# EAGLE design main (EAGLE 6.6.0)
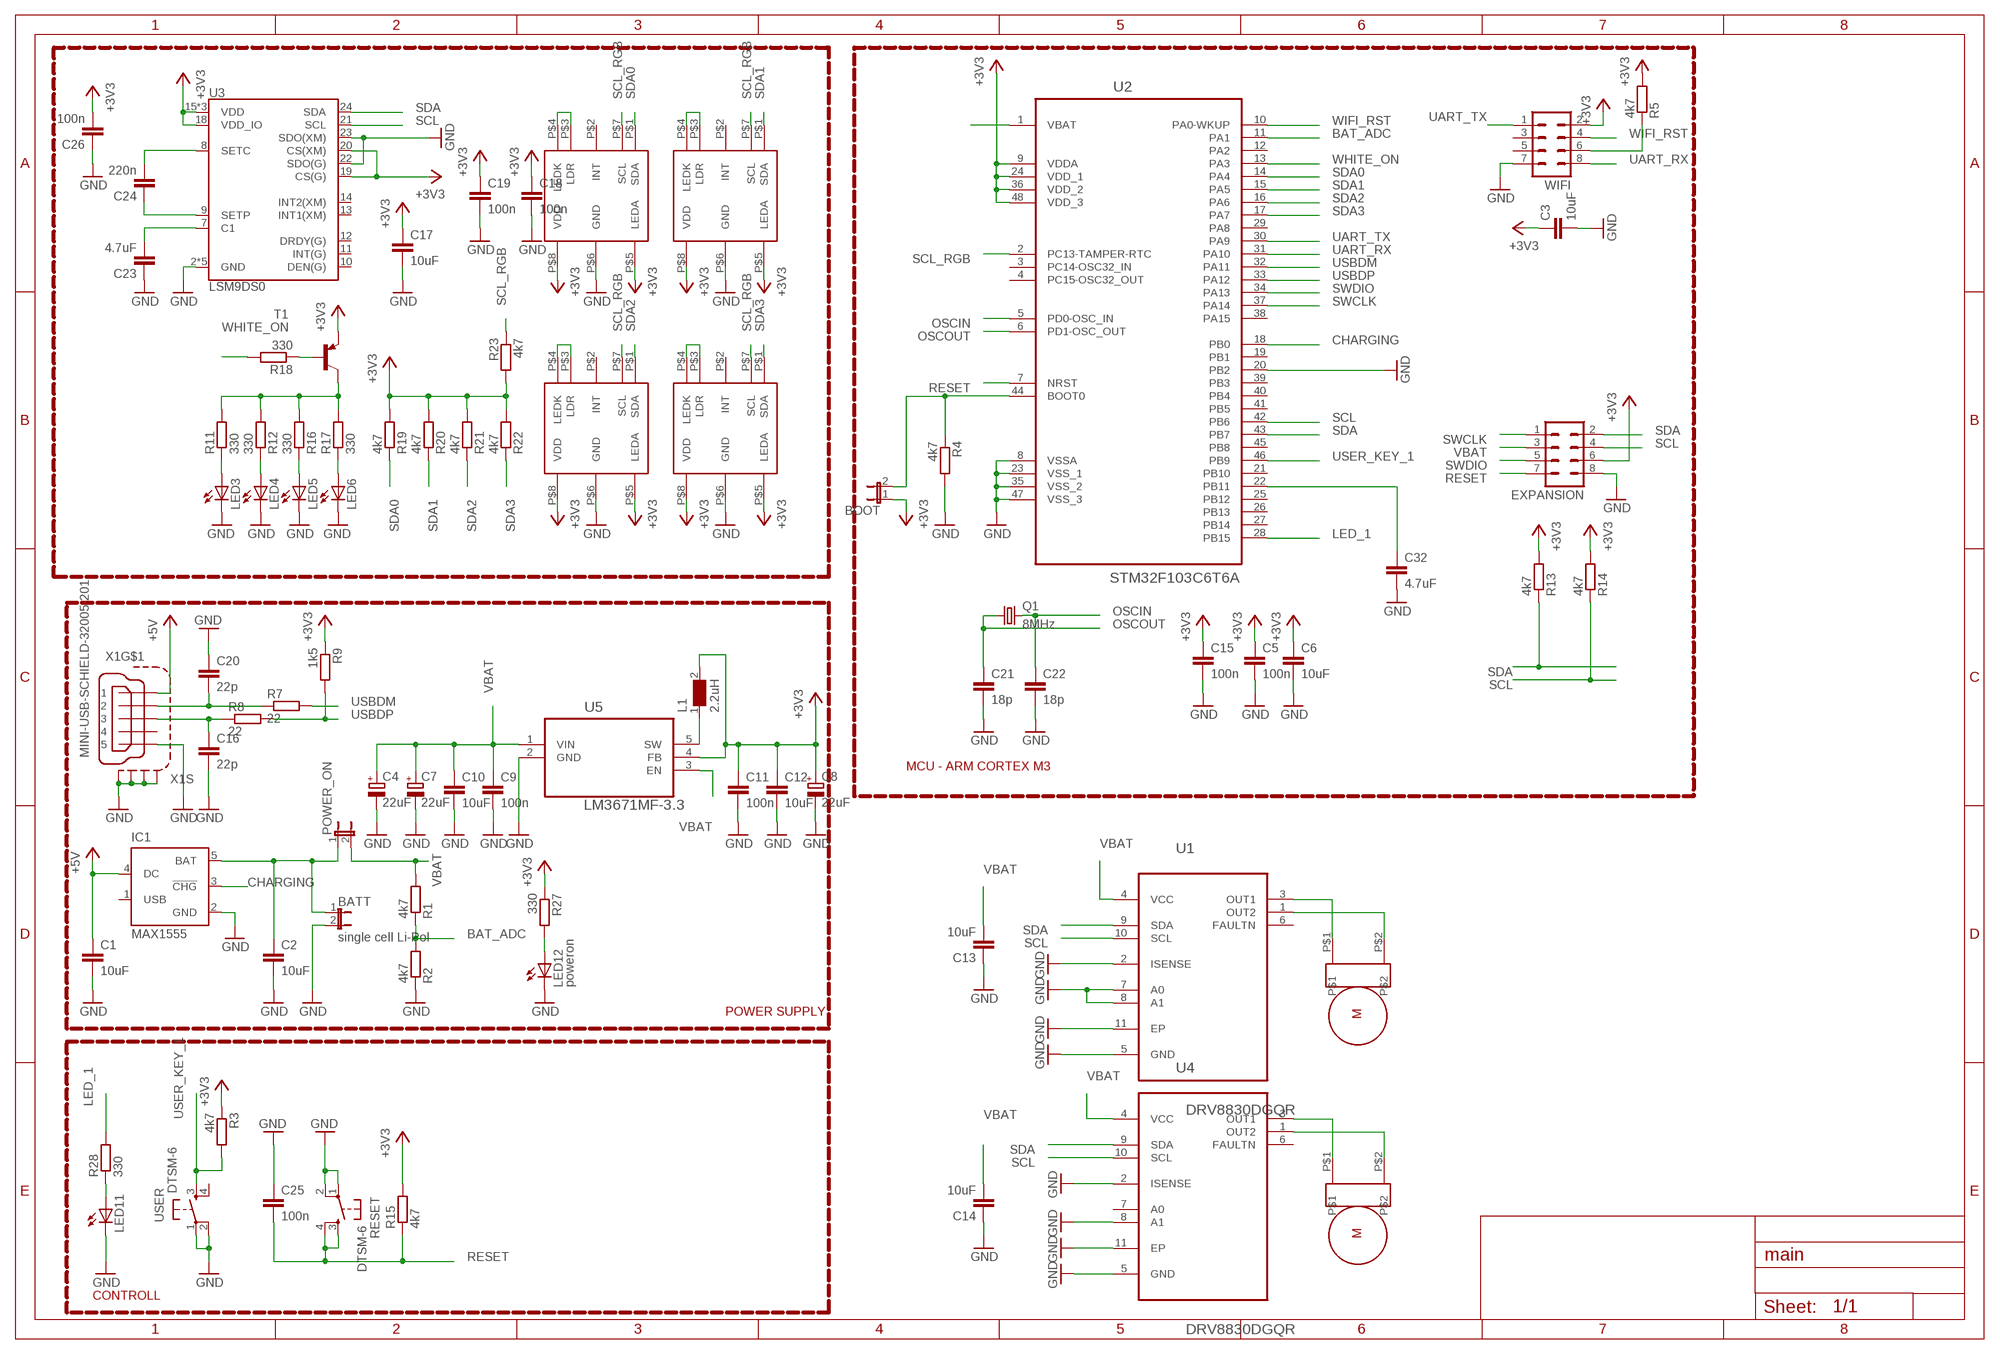
[diagram p0: schematic, sheet 1]

## Parts
BATT  single cell Li-Pol  JP1E  [JP1]
BOOT  JP1E  [JP1]
C1  10uF  C-EUC0805  [C0805]
C2  10uF  C-EUC0805  [C0805]
C3  10uF  C-EUC0805  [C0805]
C4  22uF  CPOL-EU153CLV-0505  [153CLV-0505]
C5  100n  C-EUC0805  [C0805]
C6  10uF  C-EUC0805  [C0805]
C7  22uF  CPOL-EU153CLV-0505  [153CLV-0505]
C8  22uF  CPOL-EU153CLV-0505  [153CLV-0505]
C9  100n  C-EUC0805  [C0805]
C10  10uF  C-EUC0805  [C0805]
C11  100n  C-EUC0805  [C0805]
C12  10uF  C-EUC0805  [C0805]
C13  10uF  C-EUC0805  [C0805]
C14  10uF  C-EUC0805  [C0805]
C15  100n  C-EUC0805  [C0805]
C16  22p  C-EUC0805  [C0805]
C17  10uF  C-EUC0805  [C0805]
C18  100n  C-EUC0805  [C0805]
C19  100n  C-EUC0805  [C0805]
C20  22p  C-EUC0805  [C0805]
C21  18p  C-EUC0805  [C0805]
C22  18p  C-EUC0805  [C0805]
C23  4.7uF  C-EUC0805  [C0805]
C24  220n  C-EUC0805  [C0805]
C25  100n  C-EUC0805  [C0805]
C26  100n  C-EUC0805  [C0805]
C32  4.7uF  C-EUC0805  [C0805]
EXPANSION  MA04-2  [MA04-2]
IC1  MAX1555  [SOT23-5L]
L1  2.2uH  WE-LQ-744032002_M  [WE-LQ_M]
LED3  LEDCHIPLED_1206  [CHIPLED_1206]
LED4  LEDCHIPLED_1206  [CHIPLED_1206]
LED5  LEDCHIPLED_1206  [CHIPLED_1206]
LED6  LEDCHIPLED_1206  [CHIPLED_1206]
LED11  LEDCHIPLED_1206  [CHIPLED_1206]
LED12  poweron  LEDCHIPLED_1206  [CHIPLED_1206]
POWER_ON  JP1E  [JP1]
Q1  8MHz  CRYSTALCTS406  [CTS406]
R1  4k7  R-EU_M0805  [M0805]
R2  4k7  R-EU_M0805  [M0805]
R3  4k7  R-EU_M0805  [M0805]
R4  4k7  R-EU_M0805  [M0805]
R5  4k7  R-EU_M0805  [M0805]
R7  22  R-EU_M0805  [M0805]
R8  22  R-EU_M0805  [M0805]
R9  1k5  R-EU_M0805  [M0805]
R11  330  R-EU_M0805  [M0805]
R12  330  R-EU_M0805  [M0805]
R13  4k7  R-EU_M0805  [M0805]
R14  4k7  R-EU_M0805  [M0805]
R15  4k7  R-EU_M0805  [M0805]
R16  330  R-EU_M0805  [M0805]
R17  330  R-EU_M0805  [M0805]
R18  330  R-EU_M0805  [M0805]
R19  4k7  R-EU_M0805  [M0805]
R20  4k7  R-EU_M0805  [M0805]
R21  4k7  R-EU_M0805  [M0805]
R22  4k7  R-EU_M0805  [M0805]
R23  4k7  R-EU_M0805  [M0805]
R27  330  R-EU_M0805  [M0805]
R28  330  R-EU_M0805  [M0805]
RESET  DTSM-6  [DTSM-6]
T1  BC857A-PNP-SOT23-BEC  [SOT23-BEC]
U1  DRV8830DGQR  [SOP65P640X110-15N]
U2  STM32F103C6T6A  [QFP50P900X900X160-48N]
U3  LSM9DS0  [LGA-24]
U4  DRV8830DGQR  [SOP65P640X110-15N]
U5  LM3671MF-3.3  [SOT95P284X122-5N]
U$1  APDS9950  [APDS9950]
U$2  APDS9950  [APDS9950]
U$3  APDS9950  [APDS9950]
U$4  APDS9950  [APDS9950]
U$5  MICRO_METAL_GEAR_MOTOR  [MICRO_METAL_GEAR_MOTOR]
U$6  MICRO_METAL_GEAR_MOTOR  [MICRO_METAL_GEAR_MOTOR]
USER  DTSM-6  [DTSM-6]
WIFI  MA04-2  [MA04-2]
X1  MINI-USB-SCHIELD-32005-201  [32005-201]

## Nets
+3V3: BOOT.1 C3.1 C5.1 C6.1 C8.+ C11.1 C12.1 C15.1 C17.1 C18.1 C19.1 C26.2 EXPANSION.6 L1.2 R3.1 R5.2 R9.1 R13.2 R14.2 R15.2 R19.2 R20.2 R21.2 R22.2 R23.2 R27.1 T1.E U2.9(VDDA) U2.24(VDD_1) U2.36(VDD_2) U2.48(VDD_3) U3.15(VDD) U3.16(VDD) U3.17(VDD) U3.18(VDD_IO) U3.19(CS(G)) U3.20(CS(XM)) U5.4(FB) U$1.P$5(LEDA) U$1.P$8(VDD) U$2.P$5(LEDA) U$2.P$8(VDD) U$3.P$5(LEDA) U$3.P$8(VDD) U$4.P$5(LEDA) U$4.P$8(VDD) WIFI.2
+5V: C1.1 IC1.4(DC) X1.1
BAT_ADC: R1.1 R2.2 U2.11(PA1)
CHARGING: IC1.3(!CHG) U2.18(PB0)
GND: BATT.2 C1.2 C2.2 C3.2 C4.- C5.2 C6.2 C7.- C8.- C9.2 C10.2 C11.2 C12.2 C13.1 C14.1 C15.2 C16.2 C17.2 C18.2 C19.2 C20.1 C21.2 C22.2 C23.1 C25.1 C26.1 C32.2 EXPANSION.8 IC1.2(GND) LED3.C LED4.C LED5.C LED6.C LED11.C LED12.C R2.1 R4.2 RESET.1 RESET.2 U1.2(ISENSE) U1.5(GND) U1.7(A0) U1.8(A1) U1.11(EP) U2.8(VSSA) U2.20(PB2) U2.23(VSS_1) U2.35(VSS_2) U2.47(VSS_3) U3.2(GND) U3.3(GND) U3.4(GND) U3.5(GND) U3.6(GND) U3.22(SDO(G)) U3.23(SDO(XM)) U4.2(ISENSE) U4.5(GND) U4.8(A1) U4.11(EP) U5.2(GND) U$1.P$6(GND) U$2.P$6(GND) U$3.P$6(GND) U$4.P$6(GND) USER.1 USER.2 WIFI.7 X1.5 X1.M1(S:S1) X1.M2(S:S2) X1.M3(S:S3) X1.M4(S:S4)
LED_1: R28.2 U2.28(PB15)
N$1: R5.1 WIFI.6
N$2: BATT.1 C2.1 IC1.5(BAT) POWER_ON.1
N$3: U1.1(OUT2) U$5.P$2
N$4: U1.3(OUT1) U$5.P$1
N$5: U4.1(OUT2) U$6.P$2
N$6: C23.2 U3.7(C1)
N$7: C24.2 U3.8(SETC)
N$8: U4.3(OUT1) U$6.P$1
N$9: L1.1 U5.5(SW)
N$13: C24.1 U3.9(SETP)
N$14: C32.1 U2.22(PB11)
N$15: LED3.A R11.1
N$16: BOOT.2 R4.1 U2.44(BOOT0)
N$17: U$1.P$3(LDR) U$1.P$4(LEDK)
N$18: U$2.P$3(LDR) U$2.P$4(LEDK)
N$19: U$3.P$3(LDR) U$3.P$4(LEDK)
N$20: U$4.P$3(LDR) U$4.P$4(LEDK)
N$22: LED4.A R12.1
N$23: LED12.A R27.2
N$24: LED5.A R16.1
N$25: LED6.A R17.1
N$26: R11.2 R12.2 R16.2 R17.2 T1.C
N$27: R18.1 T1.B
N$33: LED11.A R28.1
N$55: C20.2 R7.1 X1.2
N$56: C16.1 R8.1 X1.3
NC: U2.1(VBAT)
OSCIN: C22.1 Q1.3 U2.5(PD0-OSC_IN)
OSCOUT: C21.1 Q1.1 U2.6(PD1-OSC_OUT)
RESET: C25.2 EXPANSION.7 R15.1 RESET.3 RESET.4 U2.7(NRST)
SCL: EXPANSION.4 R14.1 U1.10(SCL) U2.42(PB6) U3.21(SCL) U4.10(SCL)
SCL_RGB: R23.1 U2.2(PC13-TAMPER-RTC) U$1.P$7(SCL) U$2.P$7(SCL) U$3.P$7(SCL) U$4.P$7(SCL)
SDA: EXPANSION.2 R13.1 U1.9(SDA) U2.43(PB7) U3.24(SDA) U4.9(SDA)
SDA0: R19.1 U2.14(PA4) U$1.P$1(SDA)
SDA1: R20.1 U2.15(PA5) U$2.P$1(SDA)
SDA2: R21.1 U2.16(PA6) U$3.P$1(SDA)
SDA3: R22.1 U2.17(PA7) U$4.P$1(SDA)
SWCLK: EXPANSION.1 U2.37(PA14)
SWDIO: EXPANSION.5 U2.34(PA13)
UART_RX: U2.31(PA10) WIFI.8
UART_TX: U2.30(PA9) WIFI.1
USBDM: R7.2 U2.32(PA11)
USBDP: R8.2 R9.2 U2.33(PA12)
USER_KEY_1: R3.2 U2.46(PB9) USER.3
VBAT: C4.+ C7.+ C9.1 C10.1 C13.2 C14.2 EXPANSION.3 POWER_ON.2 R1.2 U1.4(VCC) U4.4(VCC) U5.1(VIN) U5.3(EN)
WHITE_ON: R18.2 U2.13(PA3)
WIFI_RST: U2.10(PA0-WKUP) WIFI.4
Unconnected: IC1.1(USB) U1.6(FAULTN) U2.3(PC14-OSC32_IN) U2.4(PC15-OSC32_OUT) U2.12(PA2) U2.19(PB1) U2.21(PB10) U2.25(PB12) U2.26(PB13) U2.27(PB14) U2.29(PA8) U2.38(PA15) U2.39(PB3) U2.40(PB4) U2.41(PB5) U2.45(PB8) U3.10(DEN(G)) U3.11(INT(G)) U3.12(DRDY(G)) U3.13(INT1(XM)) U3.14(INT2(XM)) U4.6(FAULTN) U4.7(A0) U$1.P$2(INT) U$2.P$2(INT) U$3.P$2(INT) U$4.P$2(INT) USER.4 WIFI.3 WIFI.5 X1.4

## Notes on the sheet
- MCU - ARM CORTEX M3
- POWER SUPPLY
- CONTROLL

## Library data of the parts
BATT BOOT POWER_ON = jumper:JP1E: JUMPER
C1-C3 C5 C6 C9-C26 C32 = resistor:C-EU: CAPACITOR, European symbol
C4 C7 C8 = resistor:CPOL-EU: POLARIZED CAPACITOR, European symbol
EXPANSION WIFI = con-lstb:MA04-2: PIN HEADER; OC_FARNELL: unknown; OC_NEWARK: unknown
IC1 = maxim:MAX1555: Dual-Input USB/AC Adapter 1-Cell Li+ Battery Chargers Source: http://www.maxim-ic.com .. MAX1551-MAX1555.pdf; MF: MAXIM; MPN: MAX1555EZK+T; OC_FARNELL: 1628222; OC_NEWARK: 59J2761
L1 = WE-LQ:WE-LQ: SMD RF Inductor WE-LQ - High Q at high frequences - Low DC-resistance - Miniature chip inductor wound on a special ferrite core -- Low power DC/DC-converters from Linear Technology, National Semiconductor, Texas Instruments and Fairchild Semiconductor ect. -- Test & measurement equipment -- EMI-Filtering -- RF-circuit; MPN: 744032002; OC_FARNELL: 1800378; OC_NEWARK: 78R5670; PACKAGE: 1210; SUPPLIER: WURTH ELEKTRONIK
LED3-LED6 LED11 LED12 = led:LED: LED OSRAM: - CHIPLED LG R971, LG N971, LY N971, LG Q971, LY Q971, LO R971, LY R971 LH N974, LH R974 LS Q976, LO Q976, LY Q976 LO Q996 - Hyper CHIPLED LW Q18S LB Q993, LB Q99A, LB R99A - SideLED LS A670, LO A670, LY A670, LG A670, LP A670 LB A673, LV A673, LT A673, LW A673 LH A674 LY A675 LS A676, LA A676, LO A676, LY A676, LW A676 LS A679, LY A679, LG A679 - Hyper Micro SIDELED® LS Y876, LA Y876, LO Y876, LY Y876 LT Y87S - SmartLED LW L88C, LW L88S LB L89C, LB L89S, LG L890 LS L89K, LO L89K, LY L89K LS L896, LA L896, LO L896, LY L896 - TOPLED LS T670, LO T670, LY T670, LG T670, LP T670 LSG T670, LSP T670, LSY T670, LOP T670, LYG T670 LG T671, LOG T671, LSG T671 LB T673, LV T673, LT T673, LW T673 LH T674 LS T676, LA T676, LO T676, LY T676, LB T676, LH T676, LSB T676, LW T676 LB T67C, LV T67C, LT T67C, LS T67K, LO T67K, LY T67K, LW E67C LS E67B, LA E67B, LO E67B, LY E67B, LB E67C, LV E67C, LT E67C LW T67C LS T679, LY T679, LG T679 LS T770, LO T770, LY T770, LG T770, LP T770 LB T773, LV T773, LT T773, LW T773 LH T774 LS E675, LA E675, LY E675, LS T675 LS T776, LA T776, LO T776, LY T776, LB T776 LHGB T686 LT T68C, LB T68C - Hyper Mini TOPLED® LB M676 - Mini TOPLED Santana® LG M470 LS M47K, LO M47K, LY M47K Source: http://www.osram.convergy.de LUXEON: - LUMILED® LXK2-PW12-R00, LXK2-PW12-S00, LXK2-PW14-U00, LXK2-PW14-V00 LXK2-PM12-R00, LXK2-PM12-S00, LXK2-PM14-U00 LXK2-PE12-Q00, LXK2-PE12-R00, LXK2-PE12-S00, LXK2-PE14-T00, LXK2-PE14-U00 LXK2-PB12-K00, LXK2-PB12-L00, LXK2-PB12-M00, LXK2-PB14-N00, LXK2-PB14-P00, LXK2-PB14-Q00 LXK2-PR12-L00, LXK2-PR12-M00, LXK2-PR14-Q00, LXK2-PR14-R00 LXK2-PD12-Q00, LXK2-PD12-R00, LXK2-PD12-S00 LXK2-PH12-R00, LXK2-PH12-S00 LXK2-PL12-P00, LXK2-PL12-Q00, LXK2-PL12-R00 Source: www.luxeon.com KINGBRIGHT: KA-3528ASYC Source: www.kingbright.com
Q1 = crystal:CRYSTAL: CRYSTAL; OC_FARNELL: unknown; OC_NEWARK: unknown
R1-R5 R7-R9 R11-R23 R27 R28 = resistor:R-EU_: RESISTOR, European symbol
RESET USER = switch-tact:DTSM-6
T1 = my_parts:*-PNP-: PNP Transistror
U1 U4 = my_parts:DRV8830DGQR: LOW-VOLTAGE MOTOR DRIVER WITH SERIAL INTERFACE; MPN: DRV8830DGQR; OC_FARNELL: 1863106; OC_NEWARK: 58T1482; PACKAGE: MSOP-10; SUPPLIER: TEXAS INSTRUMENTS
U2 = stm32f103_lqfp48:STM32F103C6T6A: MCU, 32BIT, 32K FLASH, 48LQFP; MPN: STM32F103C6T6A; OC_FARNELL: 1972391; OC_NEWARK: 72T2643; PACKAGE: 48LQFP; SUPPLIER: STMicroelectronics
U3 = main:LSM9DS0: LSM9DS0 3D Accelerometer, 3D Gyroscope, 3D Magnetomter Features: 3 acceleration channels, 3 angular rate channels, 3 magnetic field channels ±2/±4/±6/±8/±16 g linear acceleration full scale ±2/±4/±8/±12 gauss magnetic full scale ±245/±500/±2000 dps angular rate full scale 16-bit data output SPI / I2C serial interfaces Analog supply voltage 2.4 V to 3.6 V Power-down mode / low-power mode Programmable interrupt generators Embedded self-test Embedded temperature sensor Embedded FIFO Position and motion detection functions Click/double-click recognition
U5 = my_parts:LM3671MF-3.3: IC BUCK SYNC 3.3V 0.6A; MPN: LM3671MF-3.3; OC_FARNELL: 1685767; OC_NEWARK: 79K7838; PACKAGE: 5-SOT-23; SUPPLIER: NationalSemiconductor
U$1-U$4 = my_parts:APDS9950
U$5 U$6 = pololu:MICRO_METAL_GEAR_MOTOR
X1 = con-cypressindustries:MINI-USB-SCHIELD-: MINI USB-B Conector Source: www.cypressindustries.com; OC_FARNELL: unknown; OC_NEWARK: unknown

## Board
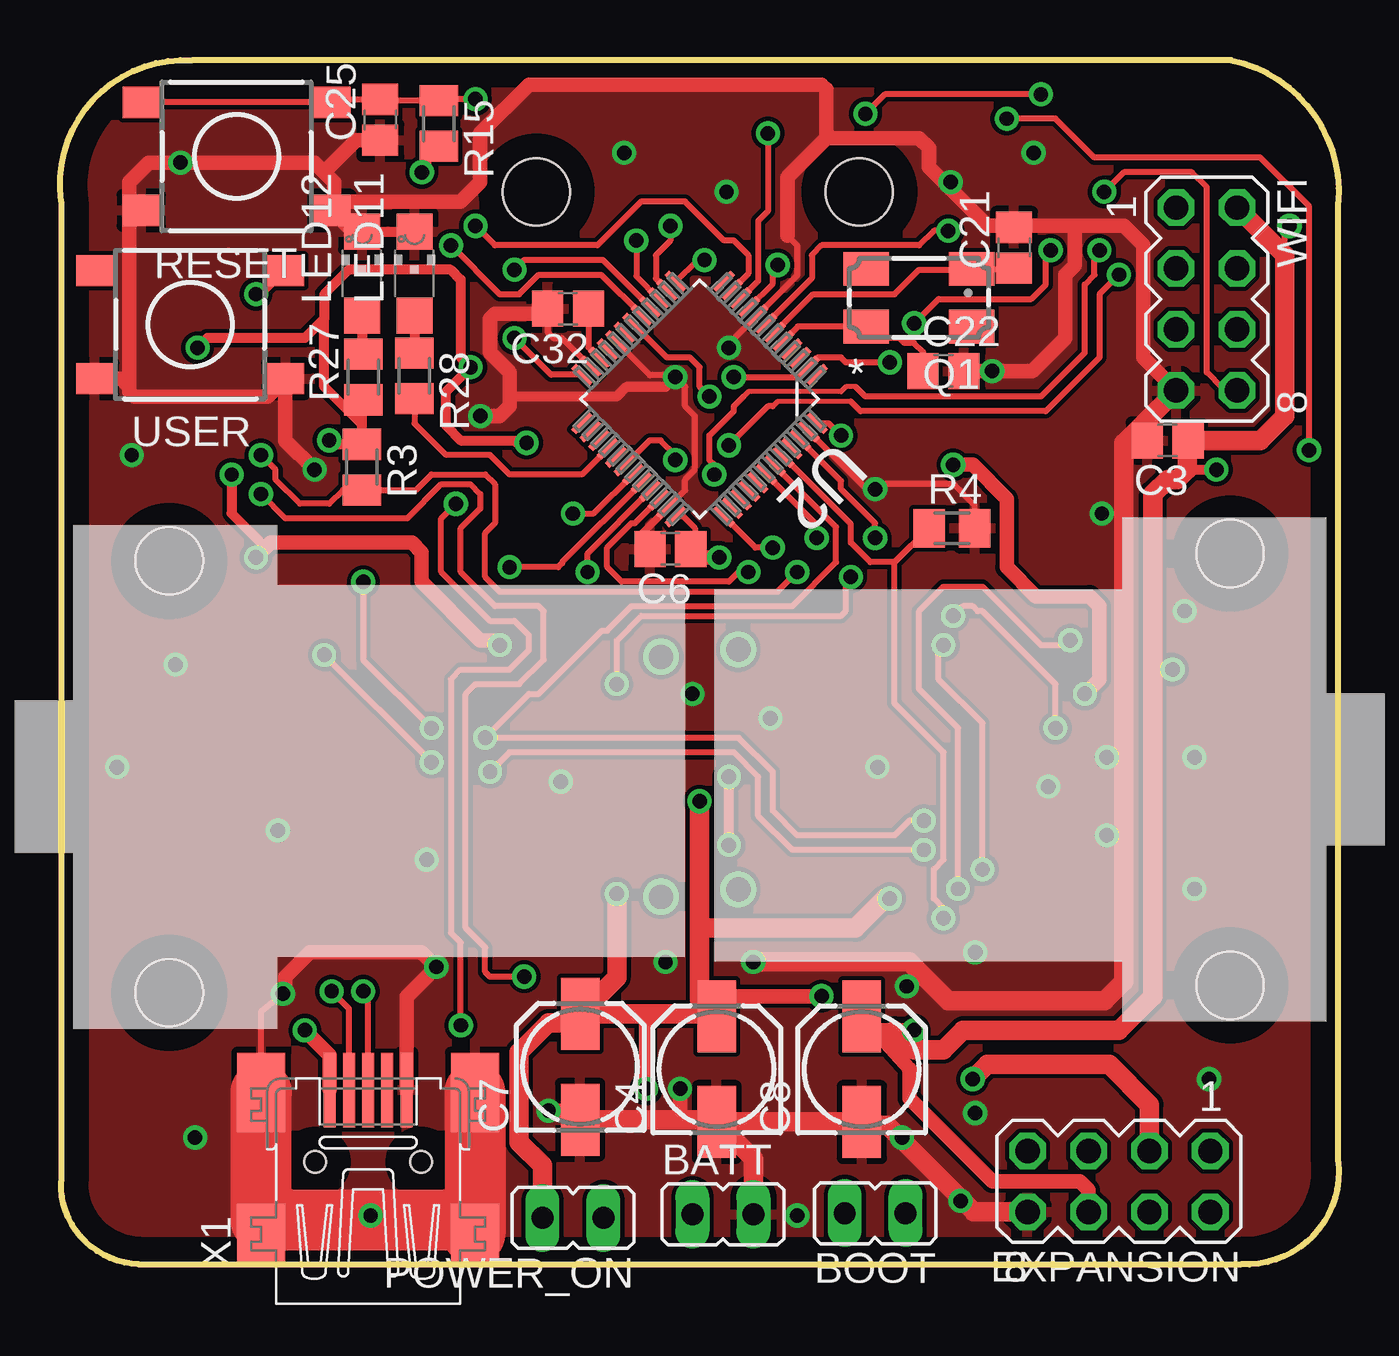
[diagram p1: board, top side]
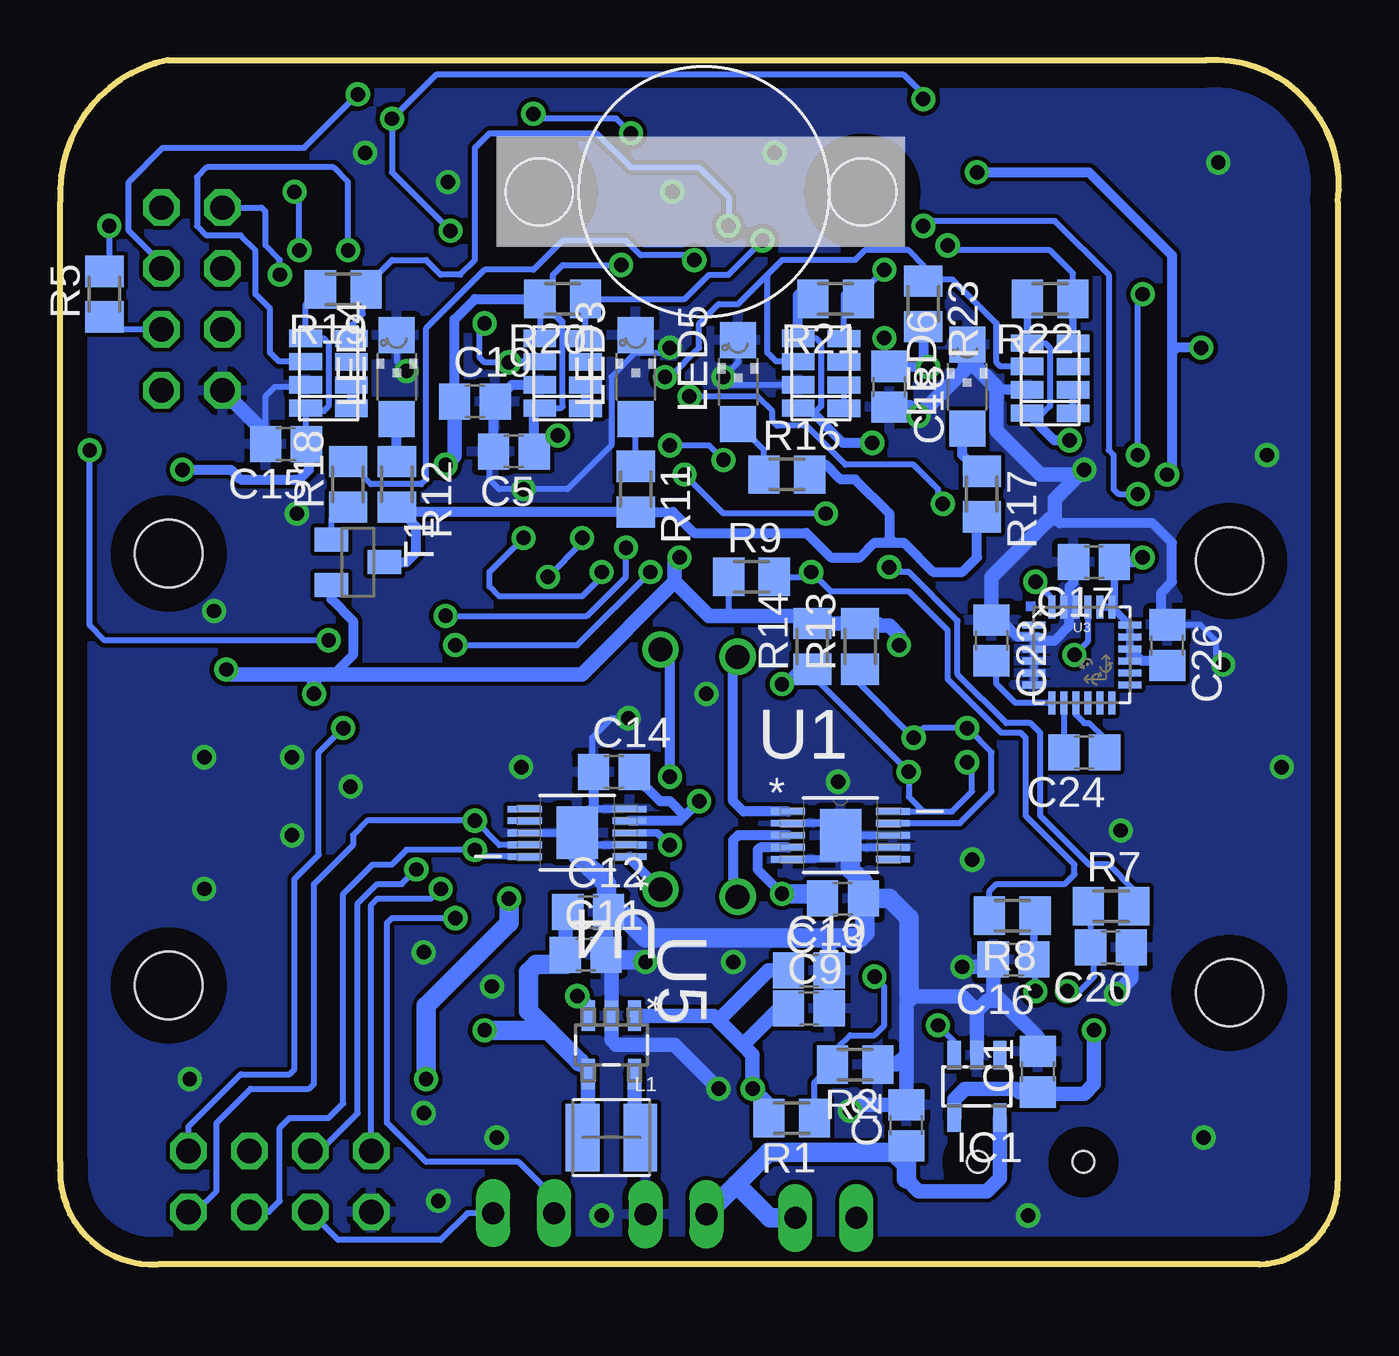
[diagram p2: board, bottom side, seen from below]

Size 53.3 x 50.2 mm. Coordinates in mm from the lower left corner, seen from the top.
Outline: 3.29,0 49.22,0 arc99 53.28,4.27 53.28,44.3 arc82 48.81,50.19 5.53,50.19 arc101 0.04,44.3 0.04,3.46 arc90 3.29,0
Copper layers (1*16): Top 0.035mm / dielectric 1.5mm / Bottom 0.035mm
Design rules "default *": minimum track width 7mil, minimum drill 24mil, track to track 7mil, track to pad 7mil, pad to pad 7mil, via to via 7mil, smd to smd 7mil, copper to edge 40mil, drill to drill 8mil, minimum pad ring 10mil, minimum via ring 8mil, stop-mask expansion 4mil, vias tented up to drill 0mil, thermal gap 10mil

### Footprints (pad centres in the part's own frame; a part is rotated, then mirrored left to right if it is on the bottom)
JP1 = drill 0.914 long: 1 0,-1.27; 2 0,1.27
C0805 = smd 1.3 x 1.5: 1 -0.85,0; 2 0.85,0
153CLV-0505 = smd 3 x 1.6: + 2.2,0; - -2.2,0
MA04-2 = drill 1.016 octagon: 1 -3.81,-1.27; 2 -3.81,1.27; 3 -1.27,-1.27; 4 -1.27,1.27; 5 1.27,-1.27; 6 1.27,1.27; 7 3.81,-1.27; 8 3.81,1.27
SOT23-5L = smd 0.55 x 1.2: 1 -0.95,-1.3; 2 0,-1.3; 3 0.95,-1.3; 4 0.95,1.3; 5 -0.95,1.3
WE-LQ_M = smd 1.4 x 2.8: 1 -1.2,0; 2 1.2,0
CHIPLED_1206 = smd 1.5 x 1.5: A 0,-1.75; C 0,1.75
CTS406 = smd 1.9 x 1.4: 1 -2.2,-1.2; 2 2.2,-1.2; 3 2.2,1.2; 4 -2.2,1.2
M0805 = smd 1.3 x 1.6: 1 -0.95,0; 2 0.95,0
DTSM-6 = smd 1.55 x 1.3: 1 -3.975,2.25; 2 3.975,2.25; 3 -3.975,-2.25; 4 3.975,-2.25
SOT23-BEC = smd 1 x 1.4: B -0.95,-1.1; C 0,1.1; E 0.95,-1.1
SOP65P640X110-15N = smd 1.422 x 0.279: 1 -2.184,0.991; 2 -2.184,0.508; 3 -2.184,0; 4 -2.184,-0.508; 5 -2.184,-0.991; 6 2.184,-0.991; 7 2.184,-0.508; 8 2.184,0; 9 2.184,0.508; 10 2.184,0.991 | smd 1.727 x 2.184: 11 0,0
QFP50P900X900X160-48N = smd 1.041 x 0.279: 1 -4.166,2.743; 2 -4.166,2.261; 3 -4.166,1.753; 4 -4.166,1.245; 5 -4.166,0.762; 6 -4.166,0.254; 7 -4.166,-0.254; 8 -4.166,-0.762; 9 -4.166,-1.245; 10 -4.166,-1.753; 11 -4.166,-2.261; 12 -4.166,-2.743; 25 4.166,-2.743; 26 4.166,-2.261; 27 4.166,-1.753; 28 4.166,-1.245; 29 4.166,-0.762; 30 4.166,-0.254; 31 4.166,0.254; 32 4.166,0.762; 33 4.166,1.245; 34 4.166,1.753; 35 4.166,2.261; 36 4.166,2.743 | smd 0.279 x 1.041: 13 -2.743,-4.166; 14 -2.261,-4.166; 15 -1.753,-4.166; 16 -1.245,-4.166; 17 -0.762,-4.166; 18 -0.254,-4.166; 19 0.254,-4.166; 20 0.762,-4.166; 21 1.245,-4.166; 22 1.753,-4.166; 23 2.261,-4.166; 24 2.743,-4.166; 37 2.743,4.166; 38 2.261,4.166; 39 1.753,4.166; 40 1.245,4.166; 41 0.762,4.166; 42 0.254,4.166; 43 -0.254,4.166; 44 -0.762,4.166; 45 -1.245,4.166; 46 -1.753,4.166; 47 -2.261,4.166; 48 -2.743,4.166
LGA-24 = smd 0.954 x 0.29: 1 -2.002,1.25; 2 -2.002,0.75; 3 -2.002,0.25; 4 -2.002,-0.25; 5 -2.002,-0.75; 6 -2.002,-1.25; 13 2.002,-1.25; 14 2.002,-0.75; 15 2.002,-0.25; 16 2.002,0.25; 17 2.002,0.75; 18 2.002,1.25 | smd 0.29 x 0.954: 7 -1.25,-2.002; 8 -0.75,-2.002; 9 -0.25,-2.002; 10 0.25,-2.002; 11 0.75,-2.002; 12 1.25,-2.002; 19 1.25,2.002; 20 0.75,2.002; 21 0.25,2.002; 22 -0.25,2.002; 23 -0.75,2.002; 24 -1.25,2.002
SOT95P284X122-5N = smd 1.27 x 0.559: 1 -1.219,0.965; 2 -1.219,0; 3 -1.219,-0.965; 4 1.219,-0.965; 5 1.219,0.965
APDS9950 = smd 1.362 x 0.72: P$1 0.954,1.4; P$2 0.954,0.43; P$3 0.954,-0.54; P$4 0.954,-1.51; P$5 -0.954,-1.5; P$6 -0.954,-0.53; P$7 -0.954,0.44; P$8 -0.954,1.41
MICRO_METAL_GEAR_MOTOR = drill 1: P$1 -5,1; P$2 5,1 | hole 2.8: -9,21.5; 9,21.5
BALL_3/8 = hole 2.8: -6.35,0; 7.112,0
32005-201 = smd 3.1 x 0.5: 1 3,1.6; 2 3,0.8; 3 3,0; 4 3,-0.8; 5 3,-1.6 | smd 2.5 x 2: M1 -3,-4.45; M2 -3,4.45 | smd 3.3 x 2: M3 2.9,4.45; M4 2.9,-4.45 | hole 0.9: 0,2.2; 0,-2.2

### Placement (x,y rotation side)
BATT  27.63,2.09 270 top
BOOT  33.98,2.14 90 top
C1  12.54,8.03 90 bottom
C2  18.03,5.79 90 bottom
C3  46.17,34.34 180 top
C4  27.37,8.13 90 top
C5  34.38,33.89 180 bottom
C6  25.44,29.82 180 top
C7  21.68,8.23 90 top
C8  33.42,8.13 90 top
C9  22.09,10.67 0 bottom
C10  22.09,12.25 0 bottom
C11  31.39,12.91 0 bottom
C12  31.29,14.68 0 bottom
C13  20.67,15.24 180 bottom
C14  30.22,20.53 0 bottom
C15  43.88,34.19 180 bottom
C16  13.56,12.7 180 bottom
C17  10.2,29.26 180 bottom
C18  18.74,36.58 270 bottom
C19  36.01,35.97 0 bottom
C20  9.49,13.21 180 bottom
C21  39.77,42.37 90 top
C22  36.82,37.24 0 top
C23  14.47,26.01 270 bottom
C24  10.61,21.34 180 bottom
C25  13.35,47.7 90 top
C26  7.16,25.81 270 bottom
C32  21.18,39.83 180 top
EXPANSION  44.14,3.46 180 top
IC1  15.08,7.42 180 bottom
L1  30.32,5.29 180 bottom
LED3  29.3,36.98 0 bottom
LED4  39.26,36.98 0 bottom
LED5  25.04,36.78 0 bottom
LED6  15.49,36.58 0 bottom
LED11  14.78,41.3 0 top
LED12  12.59,41.3 0 top
POWER_ON  21.38,1.93 90 top
Q1  35.81,40.29 180 top
R1  22.8,6.1 180 bottom
R2  20.16,8.33 180 bottom
R3  12.59,33.23 270 top
R4  37.18,30.69 0 top
R5  51.45,40.44 90 bottom
R7  9.49,14.94 0 bottom
R8  13.61,14.53 180 bottom
R9  24.48,28.65 0 bottom
R11  29.3,32.31 270 bottom
R12  39.26,32.51 270 bottom
R13  19.96,25.76 90 bottom
R14  21.94,25.76 90 bottom
R15  15.79,47.55 270 top
R16  23.01,32.92 0 bottom
R17  14.88,32.11 270 bottom
R18  41.29,32.51 90 bottom
R19  41.5,40.64 180 bottom
R20  32.35,40.24 180 bottom
R21  20.97,40.24 180 bottom
R22  12.03,40.24 180 bottom
R23  17.32,40.03 270 bottom
R27  12.64,36.98 90 top
R28  14.78,37.04 270 top
RESET  7.36,46.18 180 top
T1  40.89,29.26 270 bottom
U1  20.77,17.88 0 bottom
U2  26.66,36.07 225 top
U3  10.71,25.4 0 bottom
U4  31.74,17.99 180 bottom
U5  30.32,9.15 270 bottom
U$1  42.11,37.19 0 bottom
U$2  32.35,37.19 0 bottom
U$3  21.58,37.19 0 bottom
U$4  12.03,36.98 0 bottom
U$5  26.05,20.32 90 top
U$6  27.27,20.63 270 top
U$7  [BALL_3/8]  26.97,44.71 0 bottom
USER  5.43,39.17 180 top
WIFI  47.8,40.24 270 top
X1  12.85,4.27 90 top

### Tracks (layer width: path | path; a pad name or v marks a point on that pad's centre or on a via)
+3V3  (via drill 0.6)
  Top 0.254: 33.79,9.76 33.79,9.96 C8.+ | U2.36 25.96,31.19 26.46,30.69 26.46,29.99 C6.1 | U2.24 20.48,37.08 v18.94,38.61 | U2.48 32.04,35.06 v32.56,34.55 | U2.9 29.71,40.88 29.71,41.46 v29.91,41.66 | 51.05,42.06 51.05,43.08 v51.25,43.28 | R15.2 15.35,46.6 15.35,45.79 v15.08,45.52
  Top 0.406: R3.1 12.59,35.98 R27.1 | C6.1 26.71,29.62 | R3.1 11.39,34.18 v11.22,34.34 | R3.1 12.59,35 11.02,36.58 11.02,39.42 | 46.98,33.12 v48.2,33.12 | 19.04,34.24 v19.45,34.24 19.35,34.34 16.71,34.34 16.1,34.95 16.1,36.38 v17.11,37.39 16.71,37.8 16.71,41.05 16.3,41.46 12.03,41.46 11.02,40.44 11.02,39.42 | v7.16,32.92 7.16,31.3 8.58,29.87 | 11.02,39.42 10.2,38.61 6.14,38.61 v5.73,38.2
  Top 0.61: EXPANSION.6 42.87,3.1 42.51,3.46 38.85,3.46 35.4,6.91 35.4,8.15 C8.+ | v35.6,9.76 34.79,9.76 33.79,9.76 | v46.37,24.79 45.76,24.79 45.56,25 | v27.48,29.47 26.65,29.47 C6.1 | v37.23,33.33 38.04,33.33 39.46,31.9 39.46,29.06 40.68,27.84 42.92,27.84 43.33,27.43 43.33,24.39 v42.72,23.78 | 7.97,29.47 v8.17,29.47 8.58,29.87 8.78,30.08 14.67,30.08 15.08,29.67 15.08,28.45 17.52,26.01 18.13,26.01 v18.33,25.81
  Top 0.813: WIFI.2 51.05,42.06 51.05,35.36 50.03,34.34 C3.1 46.98,34.31 46.98,33.12 46.58,32.72 46.17,32.72 45.56,32.11 45.56,25 45.56,11.18 44.14,9.76 37.64,9.76 36.82,8.94 35.6,8.94 34.79,9.76
  Bottom 0.254: BOOT.1 36.31,2.14 37.43,1.02 41.7,1.02 EXPANSION.6 | U$4.P$8 12.22,38.39 12.03,38.2 12.03,35.77 12.44,35.36 12.86,35.36 U$4.P$5 | U$3.P$8 21.77,38.6 21.58,38.41 21.58,35.77 21.79,35.56 21.99,35.56 22.41,35.56 | 17.32,37.59 v17.11,37.39 | C26.2 6.95,25.15 | R9.1 25.43,27.22 25.24,27.03 | C15.1 43.06,34.22 U$1.P$5 42.93,35.56 42.31,35.56 42.11,35.77 42.11,38.41 42.3,38.6 U$1.P$8 43.06,40.03 R19.2 | U$2.P$8 R20.2 32.35,39.29 | U$2.P$5 32.43,35.69 32.35,35.77 32.35,39.29 | v18.94,38.61 18.94,37.63 | v32.56,34.55 32.87,34.55 C5.1 | 32.35,39.29 32.42,39.29 32.76,39.63 32.76,41.25 32.35,41.66 v29.91,41.66 | v51.25,43.28 51.25,41.59 R5.2
  Bottom 0.305: C17.1 9.35,27.39 U3.19 | U3.15 U3.16 U3.17 U3.18 U3.19 | U3.20 U3.19 | U$4.P$8 R22.2
  Bottom 0.406: R13.2 19.23,26.71 | 22.26,27.03 R14.2 | 18.94,37.63 C18.1 | U$3.P$8 22.54,40.44 R21.2 | v11.22,34.34 11.84,34.34 U$4.P$5 | 6.74,25.15 6.95,25.15 8.21,25.15 U3.16 | v19.45,34.24 20.67,34.24 21.99,35.56 | U$3.P$5 22.41,35.56 | C5.1 33.53,35.46 U$2.P$5 | 18.57,37.59 C18.1 | R23.2 17.32,37.8 v17.11,37.39 18.7,37.39 C18.1 | C19.1 36.86,39.39 36.01,40.24 R20.2 | T1.E 41.99,27.72 41.09,26.82 41.09,25.4 41.9,24.59 | v48.2,33.12 46.17,33.12 45.76,32.72 43.33,32.72 42.92,33.12 42.92,34.08 C15.1 | C17.1 8.37,29.26 v8.17,29.47 | v15.08,45.52 10.41,45.52 6.95,42.06 6.95,38 | 6.95,38 6.95,33.12 v7.16,32.92 | v5.73,38.2 6.75,38.2 6.95,38
  Bottom 0.61: L1.2 31.34,5.47 31.34,5.9 31.29,5.95 U5.4 31.29,8.08 31.64,8.44 32.35,9.15 | 32.24,12.51 C11.1 32.24,14.58 C12.1 | 27.68,28.45 31.54,24.59 41.9,24.59 42.51,24.59 | 42.51,24.59 46.17,24.59 v46.37,24.79 | v18.33,25.81 18.33,26.22 18.74,26.62 19.14,26.62 19.23,26.71 | R13.2 R14.2 | 22.26,27.03 25.24,27.03 26.26,27.03 27.68,28.45 | 27.68,28.45 27.68,29.26 v27.48,29.47 | C19.1 36.86,33.7 v37.23,33.33 | v42.72,23.78 42.72,24.39 42.51,24.59
  Bottom 0.813: 32.24,12.51 33.46,12.51 33.77,12.19 33.77,10.57 32.96,9.76 | 32.96,9.76 31.64,8.44 | v35.6,9.76 32.96,9.76
+5V  (via drill 0.6)
  Top 0.61: X1.1 11.25,8.71 v10.2,9.76
  Bottom 0.61: IC1.4 16.03,6.88 15.59,7.32 13.45,7.32 13.32,7.18 C1.1 12.48,7.11 10.61,7.11 10.2,7.52 v10.2,9.76
BAT_ADC  (via drill 0.6)
  Top 0.254: v19.35,11.99 17.93,11.99 17.72,12.19 17.72,13.21 16.91,14.02 16.91,23.78 17.32,24.18 19.14,24.18 20.16,25.2 20.16,27.23 19.96,27.43 18.13,27.43 16.71,28.86 16.71,30.69 17.52,31.5 17.52,32.11 17.11,32.51 15.89,32.51 14.47,31.09 9.39,31.09 v8.37,32.11 | U2.11 28.69,41.3 28.69,42.06 28.09,42.67 27.68,42.67 26.05,44.3 24.22,44.3 22.4,42.47 18.13,42.47 v17.32,43.28
  Bottom 0.254: R1.1 21.85,7.59 R2.2 21.11,9.01 20.91,9.01 20.36,9.55 19.35,9.55 18.94,9.96 18.94,11.58 v19.35,11.99 | v17.32,43.28 17.11,43.49 11.83,43.49 9.59,41.25 9.59,33.94 9.39,33.73 9.39,32.31 9.19,32.11 v8.37,32.11
CHARGING  (via drill 0.6)
  Top 0.254: 23.9,39.14 U2.18 25.29,37.8 26.26,37.8 26.66,37.39 26.66,36.58 v27.07,36.17 | v16.71,9.96 16.71,13.41 16.3,13.82 16.3,24.39 16.71,24.79 18.74,24.79 19.55,25.61 19.55,26.22 18.94,26.82 17.93,26.82 15.89,28.86 15.89,31.09 v16.5,31.7
  Bottom 0.254: v27.07,36.17 24.22,36.17 23.61,35.56 23.61,35.16 23.41,34.95 22.19,34.95 20.57,33.33 17.72,33.33 16.71,32.31 16.71,31.9 v16.5,31.7 | IC1.3 16.03,9.28 v16.71,9.96
GND  (via drill 0.6)
  Top 0.254: U2.23 20.93,38.61 20.57,38.61 20.33,38.85 C32.2 | 23.18,38.44 U2.20 24.59,37.06 25.57,37.06 v25.65,36.98 26.05,36.58 26.05,35.77 26.46,35.36 26.46,33.12 26.05,32.72 26.05,32.26 24.96,31.17 | U2.47 33.62,32.31 v33.98,32.31 34.18,32.51 37.23,32.51 38.13,31.62 R4.2 | v27.88,38.2 27.88,38.37 U2.8 30.73,41.21 30.73,42.47 30.32,42.88 | 17.25,1.22 X1.M1 | X1.M3 8.4,10.55 v9.29,11.28 | RESET.2 3.06,43.93 2.89,44.1
  Top 0.305: C6.2 24.19,30.4 24.96,31.17 U2.35
  Top 0.406: 12.56,43.08 LED12.C LED11.C | C3.2 44.75,34.34 44.34,33.94 | 18.74,36.38 18.94,36.17 23.21,36.17 23.61,36.58 25.24,36.58 v25.65,36.98
  Top 0.61: v20.36,6.4 21.31,6.4 C7.- | v25.85,7.32 25.85,6.03 | v17.52,35.36 18.33,35.36 18.74,35.77 18.74,36.38 18.74,37.19 17.93,38 17.93,39.42 18.13,39.63 20.12,39.63 C32.2 | C22.2 v38.85,37.24 40.53,37.24 41.9,38.61 41.9,41.25 42.31,41.66 42.31,43.28 | 39.83,43.28 C21.2 | 39.83,43.28 38.65,43.28 36.21,45.72 36.21,46.54 35.81,46.94 31.95,46.94 | 39.83,43.28 42.31,43.28 | 42.31,43.28 44.34,43.28 45.15,42.47 45.15,37.8 WIFI.7 | 31.95,46.94 31.95,48.97 31.74,49.18 19.55,49.18 17.52,47.14 17.52,45.11 16.71,44.3 11.7,44.3 RESET.1 | 31.95,46.94 30.32,45.32 30.32,42.88 | X1.5 14.45,11.15 v15.69,12.4 15.08,13.01 10.41,13.01 9.39,11.99 9.39,11.38 v9.29,11.28 | 2.89,36.58 2.89,44.1 2.89,45.11 3.7,45.93 10.61,45.93 11.02,45.52 | USER.2 2.55,36.92 2.89,36.58 | 11.02,45.52 11.42,45.11 11.42,44.02 RESET.1 | 12.56,43.08 12.18,43.08 RESET.1 | C25.1 12.35,46.85 11.02,45.52 | 2.89,36.58 2.89,36.38 3.09,36.17 8.66,36.17 USER.1 9.39,36.91 9.39,34.34 v10.61,33.12
  Top 0.813: C7.- 25.85,6.03 27.27,6.03 C4.- | C4.- 32.66,5.93 | 32.66,5.93 C8.- | 27.68,5.63 C4.- | EXPANSION.8 38.09,2.19 34.49,5.79 32.79,5.79 32.66,5.93 | v28.9,12.6 35.4,12.6 37.03,10.98 43.53,10.98 44.34,11.79 44.34,33.94 44.34,34.24 WIFI.7 | BATT.2 28.9,4.41 C4.-
  Top 2.54: X1.M4 X1.M1 | 17.25,1.22 17.25,1.83 8.37,1.83 8.37,7.17 X1.M3
  Bottom 0.254: C15.2 44.73,36.19 44.34,36.58 43.14,36.58 U$1.P$6 | U$3.P$6 25.32,36.66 v25.65,36.98 25.04,37.59 LED5.C | LED3.C 29.3,38 | 29.3,38 30.32,36.98 30.32,34.14 32.15,32.31 v33.98,32.31 34.99,32.31 35.4,32.72 35.4,33.72 C5.2 | LED4.C 39.26,37.65 v38.85,37.24 | 29.3,38 28.09,38 v27.88,38.2 | v29.61,22.76 30.32,22.76 31.13,21.95 31.13,20.59 C14.1 | v4.82,25 5.12,25.3 5.12,26.01 5.77,26.66 C26.1 7.23,26.66 7.4,26.82
  Bottom 0.305: U1.8 U1.11 | U1.7 20.26,17.38 20.36,17.48 | 20.36,17.48 U1.11 | U1.2 21.28,18.39 U1.11 | U1.5 20.95,16.89 20.47,17.38 20.36,17.48 | U4.2 31.23,17.48 U4.11 | U4.5 31.26,18.98 31.54,18.7 31.54,18.49 31.54,18.19 U4.11 | U4.8 U4.11 | 11.22,29.43 C17.2 | 11.05,27.37 U3.22 | 11.42,27.24 U3.23 | U3.2 U3.3 U3.4 U3.5 U3.6
  Bottom 0.406: C14.1 31.07,18.96 31.54,18.49 | C23.1 14.23,26.62 13.86,26.62 13.39,26.15 U3.2 12.58,26.15 12.44,26.01 11.83,26.01 11.22,26.62 11.22,27.16 | 11.22,27.16 U3.23 11.22,27.65 11.22,28.25 11.05,28.41 C17.2 11.02,29.3 | 11.22,27.16 11.2,27.16 U3.22 | 13.78,36.45 U$4.P$6 14.35,36.45 15.59,37.7 15.49,37.8 LED6.C | 18.7,35.77 C18.2 | 7.4,26.66 7.4,26.82 7.4,28.01 6.95,28.45 6.95,30.08 7.77,30.89 11.63,30.89 11.83,31.09 | C9.2 C10.2 | U$2.P$6 34.47,36.66 C19.2 35.23,35.89 C5.2
  Bottom 0.61: 20.12,6.44 v20.36,6.4 20.12,6.64 C2.2 18.03,8.74 | IC1.2 15.08,10.57 | 15.08,10.57 14.67,10.98 14.06,10.98 | 14.06,10.98 14.41,11.32 C16.2 14.71,12.4 v15.69,12.4 | v25.85,7.32 27.68,9.15 30.12,9.15 30.32,9.35 U5.2 30.32,12.69 C11.2 30.54,14.58 C12.2 | C23.1 14.47,28.65 12.03,31.09 11.83,31.09 11.83,31.9 v10.61,33.12 10.81,32.92 12.44,32.92 14.27,34.75 14.27,36.58 15.49,37.8 | 15.59,37.7 15.59,37.29 v17.52,35.36 17.89,35.73 C18.2 | C15.2 44.73,34.63 WIFI.7 | C10.2 21.24,13.55 21.18,13.62 | 15.08,10.57 15.69,11.18 17.72,11.18 | 17.72,11.18 17.93,11.18 | C1.2 12.54,9.45 14.06,10.98 | 18.03,8.74 18.03,10.87 17.72,11.18 | R2.1 18.43,8.33 18.03,8.74 | C20.1 8.64,11.93 v9.29,11.28
  Bottom 0.813: 20.47,17.38 20.36,17.27 20.36,16.46 19.82,15.92 C13.1 | C13.1 18.74,15.24 17.93,14.43 17.93,11.18 | 30.52,15.24 28.9,13.62 21.18,13.62 19.96,13.62 19.75,13.82 19.75,15.18 C13.1 | U4.11 31.74,17.07 30.52,15.85 30.52,14.77 C12.2 | 30.32,12.69 28.99,12.69 v28.9,12.6
  other vias: 15.28,16.87 9.09,18.09 20.87,20.12 34.08,20.73 47.29,21.14 43.63,21.14 41.19,19.92 47.9,7.72 43.63,17.88 25.24,12.6 30.73,2.03 2.38,20.73 23.51,46.33 46.88,27.23 43.43,31.3 47.29,15.65 37.13,45.11 38.14,6.3 38.14,13.01 35.3,11.58 37.53,2.64 26.36,23.78 40.58,46.33 27.78,44.71 5.02,45.93 2.99,33.73 5.63,5.29 35.1,5.29 12.95,2.03
  pour Bottom: -6.46,55.48 58.97,55.48 58.97,-7.11 -6.46,-7.11
  pour Top: -2.6,52.43 62.63,52.43 62.63,-18.29 -2.6,-18.29
LED_1
  Top 0.254: R28.2 14.78,35.05 16.1,33.73 17.93,33.73 18.74,32.92 21.75,32.92 U2.28
N$1
  Bottom 0.254: WIFI.6 50.93,38.97 R5.1
N$2
  Bottom 0.61: IC1.5 14.13,3.59 14.67,3.05 17.52,3.05 18.03,3.56 C2.1
  Bottom 0.813: 25.11,3.33 23.77,4.68 18.53,4.68 18.03,4.17 18.03,3.56 | 25.11,3.33 BATT.1 | POWER_ON.1 23.72,1.93 25.11,3.33
N$3
  Bottom 0.406: U1.1 24.81,18.87 25.24,19.31 25.24,25.14 U$5.P$2
N$4
  Bottom 0.406: U1.3 25.04,17.88 25.24,17.68 25.24,15.51 U$5.P$1
N$5
  Bottom 0.406: U$6.P$2 29.49,16.85 29.49,16.93 U4.1
N$6
  Bottom 0.254: U3.7 13.48,23.4 14.27,24.18 14.27,24.96 C23.2
N$7
  Bottom 0.254: 11.46,21.75 C24.2 U3.8
N$8  (via drill 0.6)
  Top 0.406: v27.88,17.48 v27.88,20.32
  Bottom 0.305: U4.3 28.39,17.99 v27.88,17.48
  Bottom 0.406: v27.88,20.32 27.88,25.24 U$6.P$1
N$9
  Bottom 0.61: U5.5 29.36,5.52 L1.1
N$13
  Bottom 0.254: C24.1 9.76,21.91 10.41,22.56 10.61,22.56 10.96,22.91 U3.9
N$14
  Top 0.254: C32.1 22.03,38.23 U2.22
N$15
  Bottom 0.254: R11.1 LED3.A
N$16  (via drill 0.6)
  Top 0.254: v36.82,14.43 36.82,14.84 36.42,15.24 36.42,16.46 36.82,16.87 36.82,21.34 34.79,23.37 34.79,29.25 R4.1 34.79,29.26 33.77,29.26 32.96,30.08 32.96,30.85 U2.44
  Bottom 0.254: BOOT.2 32.71,2.8 34.18,4.27 38.04,4.27 39.67,5.9 39.67,14.23 39.46,14.43 v36.82,14.43
N$17
  Bottom 0.406: U$1.P$3 U$1.P$4
N$18
  Bottom 0.406: U$2.P$3 U$2.P$4
N$19
  Bottom 0.254: U$3.P$3 U$3.P$4
N$20
  Bottom 0.305: U$4.P$3 U$4.P$4
N$22
  Bottom 0.406: R12.1 LED4.A
N$23
  Top 0.406: LED12.A 12.59,37.99 R27.2
N$24
  Bottom 0.254: R16.1 23.96,33.95 LED5.A
N$25
  Bottom 0.254: 14.88,34.22 LED6.A
  Bottom 0.406: R17.1 15.01,33.06 15.69,33.73 15.69,34.63 LED6.A
N$26
  Bottom 0.406: T1.C 38.85,29.26 38.45,29.67 38.45,30.75 R12.2 39.06,31.36 R11.2 27.74,31.36 26.87,30.48 22.19,30.48 21.18,29.47 19.96,29.47 19.35,30.08 18.53,30.08 | 15.01,31.3 R17.2 15.08,30.95 15.08,29.47 15.69,28.86 16.91,28.86 18.13,30.08 18.53,30.08 | R16.2 21.38,33.33 20.77,32.72 20.16,32.72 18.74,31.3 18.74,30.28 18.53,30.08
N$27
  Bottom 0.254: T1.B 41.99,31.07 R18.1
N$33
  Top 0.406: LED11.A R28.1
N$55  (via drill 0.6)
  Top 0.254: X1.2 12.05,10.66 v11.32,11.38
  Bottom 0.254: R7.1 10.34,14.84 C20.2 10.2,13.07 10.2,11.99 10.81,11.38 v11.32,11.38
N$56  (via drill 0.6)
  Top 0.254: X1.3 12.85,11.18 v12.64,11.38
  Bottom 0.254: v12.64,11.38 12.64,12.64 C16.1
  Bottom 0.305: C16.1 12.71,14.48 R8.1
OSCIN
  Top 0.254: Q1.3 30.76,39.09 U2.5 | 33.68,39.02 Q1.3 | C22.1 35.97,38.04 35.6,38.41 35.2,38.41 34.99,38.61 34.08,38.61 Q1.3
OSCOUT
  Top 0.254: Q1.1 37.67,41.49 | U2.6 31.39,40.44 34.79,40.44 35.81,41.46 37.98,41.46 Q1.1 | Q1.1 39.74,41.49 C21.1
RESET  (via drill 0.6)
  Top 0.254: v37.43,15.65 37.43,22.35 35.81,23.98 35.81,27.23 36.82,28.25 38.45,28.25 40.89,25.81 41.9,25.81 v42.11,26.01 | v52.06,33.94 52.06,44.1 50.03,46.13 43.12,46.13 41.5,47.75 v39.46,47.75 | v37.03,43.08 36.42,43.08 35.81,42.47 31.74,42.47 31.34,42.06 31.34,41.1 U2.7 | RESET.4 RESET.3 11.46,48.55 C25.2 13.41,48.5 R15.1 15.86,48.57 v17.32,48.57
  Bottom 0.254: EXPANSION.7 40.33,14.99 40.07,15.24 37.84,15.24 v37.43,15.65 | v42.11,26.01 51.45,26.01 52.06,26.62 v52.06,33.94 | v37.03,43.08 39.46,45.52 v39.46,47.75 37.64,49.58 18.13,49.58 17.32,48.77 v17.32,48.57
SCL  (via drill 0.6)
  Top 0.254: v36.01,17.27 30.52,17.27 29.1,18.7 29.1,20.32 28.09,21.34 18.74,21.34 v17.93,20.53 | v11.02,25.4 v15.49,20.93 | v23.21,24.18 23.21,26.01 24.22,27.03 32.56,27.03 32.76,27.23 32.76,28.45 v32.96,28.65 | v31.54,30.28 31.54,30.83 U2.42
  Bottom 0.254: EXPANSION.4 44.6,2.19 44.14,2.64 44.14,5.69 43.73,6.1 42.11,6.1 41.5,6.71 41.5,15.45 40.28,16.66 39.46,16.66 38.85,17.27 v36.01,17.27 35.73,17 U4.10 | U3.21 10.46,25.96 v11.02,25.4 | U1.10 17.32,18.87 | 17.32,18.87 16.12,18.87 15.28,19.71 15.28,20.73 v15.49,20.93 | 17.32,18.87 17.93,19.48 v17.93,20.53 21.94,24.54 R14.1 22.58,24.81 v23.21,24.18 | v31.54,30.28 31.54,30.08 v32.96,28.65
SCL_RGB  (via drill 0.6)
  Top 0.254: v34.59,37.59 32.76,37.59 32.56,37.8 31.59,37.8 U2.2 30.77,36.98 v28.09,36.98 | v35.6,39.22 36.62,40.24 40.48,40.24 41.09,40.85 41.09,42.06 v41.29,42.27
  Bottom 0.254: U$4.P$7 14.1,37.42 14.27,37.59 14.27,39.22 16.1,41.05 17.25,41.05 R23.1 | U$3.P$7 23.45,37.63 23.82,38 23.82,41.25 | 17.79,41.46 R23.1 | R23.1 17.32,41.66 17.93,42.27 19.75,42.27 20.16,41.86 23.21,41.86 23.82,41.25 | U$2.P$7 34.55,37.63 v34.59,37.59 35.6,37.59 35.81,37.8 35.81,39.02 v35.6,39.22 | v28.09,36.98 27.88,36.98 26.66,38.2 26.66,39.22 25.85,40.03 25.04,40.03 23.82,41.25 | U$1.P$7 44.17,37.63 44.54,38 44.54,39.83 45.15,40.44 45.15,42.27 45.76,42.88 47.19,42.88 47.59,43.28 47.59,45.32 47.19,45.72 41.9,45.72 41.29,45.11 v41.29,42.27
SDA  (via drill 0.6)
  Top 0.254: v36.01,18.49 35.4,18.49 34.79,17.88 30.73,17.88 29.71,18.9 29.71,20.53 28.29,21.95 v17.72,21.95 19.55,23.78 19.96,23.78 22.6,26.42 22.8,26.42 23.82,27.43 30.52,27.43 32.35,29.26 32.35,30.74 U2.43 | v12.64,28.45 12.64,25.2 v15.49,22.35
  Bottom 0.254: EXPANSION.2 47.64,2.19 46.78,3.05 46.78,5.9 45.36,7.32 42.92,7.32 42.72,7.52 42.72,15.85 41.09,17.48 41.09,17.88 40.48,18.49 v36.01,18.49 34.99,17.48 U4.9 | U3.24 11.96,27.77 v12.64,28.45 | v15.49,22.35 17.32,22.35 v17.72,21.95 19.96,24.18 R13.1 | U1.9 15.79,18.39 14.47,19.71 14.47,21.34 v15.49,22.35 | 15.28,22.15 v15.49,22.35
SDA0  (via drill 0.6)
  Top 0.254: v25.44,43.28 25.44,42.67 24.83,42.06 24.83,41.1 U2.14
  Bottom 0.254: U$1.P$1 41.16,39.15 40.68,39.63 40.68,40.51 R19.1 40.95,40.24 41.09,40.24 39.46,41.86 38.04,41.86 37.43,41.25 36.62,41.25 36.01,41.86 36.01,46.54 35.4,47.14 30.93,47.14 29.51,45.72 26.66,45.72 25.44,44.5 v25.44,43.28 25.44,43.08
SDA1  (via drill 0.6)
  Top 0.254: v24.02,42.67 24.02,41.19 U2.15
  Bottom 0.254: U$2.P$1 R20.1 | R20.1 | R20.1 27.28,40.23 26.26,41.25 25.44,41.25 24.63,42.06 v24.02,42.67
SDA2  (via drill 0.6)
  Top 0.254: U2.16 22.63,41.86 19.35,41.86 v18.94,41.46
  Bottom 0.254: U$3.P$1 20.63,40.44 R21.1 20.02,40.37 v18.94,41.46
SDA3  (via drill 0.6)
  Top 0.254: U2.17 22.56,41.25 19.96,41.25 19.14,40.44 18.33,40.44 v16.3,42.47
  Bottom 0.254: R22.1 11.08,41.31 12.03,42.27 16.1,42.27 v16.3,42.47
  Bottom 0.305: U$4.P$1 R22.1
SWCLK  (via drill 0.6)
  Top 0.254: v41.5,22.35 41.5,24.18 38.45,27.23 38.25,27.23 38.04,27.43 37.64,27.43 v37.23,27.03 | v29.71,29.87 28.98,29.87 U2.37
  Bottom 0.254: EXPANSION.1 47.95,5.74 45.76,7.93 43.73,7.93 43.53,8.13 43.53,16.06 42.51,17.07 42.51,21.34 v41.5,22.35 | v37.23,27.03 31.34,27.03 29.71,28.65 v29.71,29.87
SWDIO  (via drill 0.6)
  Top 0.254: v28.69,28.86 28.29,28.86 27.88,28.45 23.41,28.45 22.8,29.06 22.8,29.87 23.82,30.89 23.96,30.89 U2.34 | v38.45,16.46 38.45,22.56 36.62,24.39 36.62,25.61 v36.82,25.81
  Bottom 0.254: EXPANSION.5 42.46,4.73 40.89,6.3 40.89,15.04 40.07,15.85 39.06,15.85 v38.45,16.46 | v28.69,28.86 31.74,25.81 v36.82,25.81
UART_RX  (via drill 0.6)
  Top 0.203: 33.17,36.58 32.76,36.58 32.56,36.38 28.69,36.38 28.49,36.17
  Top 0.254: WIFI.8 49.07,36.53 48.46,36.53 47.8,37.19 47.8,44.91 47.19,45.52 44.34,45.52 v43.53,44.71 | U2.31 22.25,31.3 v21.38,31.3 | 33.17,36.58 33.57,36.17 40.89,36.17 42.72,38 42.72,40.85 43.12,41.25 43.12,42.06 v43.33,42.27 | v27.27,32.92 27.27,33.33 27.07,33.53 27.07,34.55 28.09,35.56 28.09,35.77 28.49,36.17
  Bottom 0.254: v21.38,31.3 25.65,31.3 v27.27,32.92 | v43.33,42.27 43.33,44.5 v43.53,44.71
UART_TX  (via drill 0.6)
  Top 0.203: 32.96,35.97 29.91,35.97 29.71,35.77
  Top 0.254: 32.96,35.97 33.37,35.56 41.09,35.56 43.33,37.8 43.33,40.44 v44.14,41.25 | v25.65,33.53 25.65,33.73 25.04,34.34 24.58,34.34 U2.30 | 29.71,35.77 29.51,35.77 v27.88,34.14
  Bottom 0.254: WIFI.1 44.9,44.05 44.75,43.89 44.75,42.47 44.14,41.86 v44.14,41.25 | v27.88,34.14 26.26,34.14 v25.65,33.53
USBDM  (via drill 0.6)
  Top 0.254: U2.32 20.93,29.26 20.93,29.22 20.77,29.06 v18.74,29.06
  Bottom 0.254: R7.2 8.54,15.61 9.59,16.66 10.41,16.66 12.44,18.7 12.44,22.15 12.85,22.56 13.86,22.56 15.89,24.59 15.89,26.82 17.93,28.86 18.53,28.86 v18.74,29.06
USBDP  (via drill 0.6)
  Top 0.254: v21.99,28.86 21.99,29.64 U2.33
  Bottom 0.254: R8.2 14.56,15.56 14.27,15.85 11.42,15.85 11.02,16.26 11.02,16.66 13.05,18.7 13.05,21.95 13.25,22.15 14.06,22.15 16.3,24.39 16.3,26.42 17.93,28.04 21.18,28.04 v21.99,28.86 22.19,28.65 R9.2
USER_KEY_1  (via drill 0.6)
  Top 0.254: v30.73,28.86 29.91,28.04 18.33,28.04 17.72,28.65 17.72,30.48 18.13,30.89 18.13,32.51 17.72,32.92 15.49,32.92 14.84,32.28 R3.2 11.79,32.28 11.22,31.7 10,31.7 8.98,32.72 8.98,33.12 v8.37,33.73 | v33.98,30.28 33.98,30.89 32.56,32.31 32.56,32.66 U2.46 | v8.17,40.44 8.42,40.44 USER.3
  Bottom 0.254: v30.73,28.86 30.73,28.65 31.54,27.84 34.99,27.84 35.4,28.25 35.4,28.86 v33.98,30.28 | v8.37,33.73 8.37,40.24 v8.17,40.44
VBAT  (via drill 0.6)
  Top 0.61: v24.43,7.32 24.43,10.23 24.63,10.43 | v31.74,11.18 28.22,11.18 C4.+
  Top 0.813: C7.+ 21.31,10.06 20.36,10.06 19.14,8.84 19.14,5.08 20.11,4.12 POWER_ON.2 | C7.+ 24.63,10.43 27.27,10.43 C4.+ 26.66,11.04 26.66,13.82 | v26.66,19.31 26.66,13.82 | v23.21,15.45 23.21,11.96 C7.+ | EXPANSION.3 45.41,6.66 43.73,8.33 38.65,8.33 v38.04,7.72 | v34.59,15.24 34.38,15.24 33.17,14.02 26.87,14.02 26.66,13.82
  Bottom 0.406: U1.4 24.12,17.38 24.22,17.27 24.22,16.46 v23.21,15.45 | U4.4 27.48,18.49 27.27,18.7 | 27.27,18.7 v26.66,19.31 | C14.2 29.37,20.39 28.29,19.31 27.88,19.31 27.27,18.7
  Bottom 0.61: R1.2 23.75,6.64 v24.43,7.32 24.43,8.74 24.83,9.15 | U5.1 26.05,10.37 25.85,10.16 | 25.85,10.16 24.83,9.15 | U5.3 31.29,10.72 v31.74,11.18 | C9.1 23.31,10.67 24.83,9.15 | C10.1 23.77,12.25 25.85,10.16
  Bottom 0.813: v23.21,15.45 21.72,15.45 C13.2 | v38.04,7.72 38.04,10.77 34.59,14.23 v34.59,15.24
WHITE_ON  (via drill 0.6)
  Top 0.254: v26.87,41.86 26.56,41.86 U2.13
  Bottom 0.254: v26.87,41.86 27.07,42.06 29.1,42.06 29.71,42.67 32.35,42.67 33.57,41.46 35.6,41.46 38.04,39.02 38.04,32.72 38.25,32.51 40.34,32.51 R18.2
WIFI_RST  (via drill 0.6)
  Top 0.254: v40.89,48.77 34.38,48.77 v33.57,47.96 | v29.51,47.14 29.51,43.89 29.1,43.49 29.1,40.99 U2.10
  Bottom 0.254: v40.89,48.77 43.12,46.54 49.01,46.54 50.44,45.11 50.44,43.08 49.07,41.71 WIFI.4 | v29.51,47.14 30.12,47.75 33.37,47.75 v33.57,47.96
(copper drawn outside any net)
  shapes: Bottom area x1